# Altium schematic sheet ESP32.SchDoc
size A; SheetNumber: 5; SheetTotal: 16
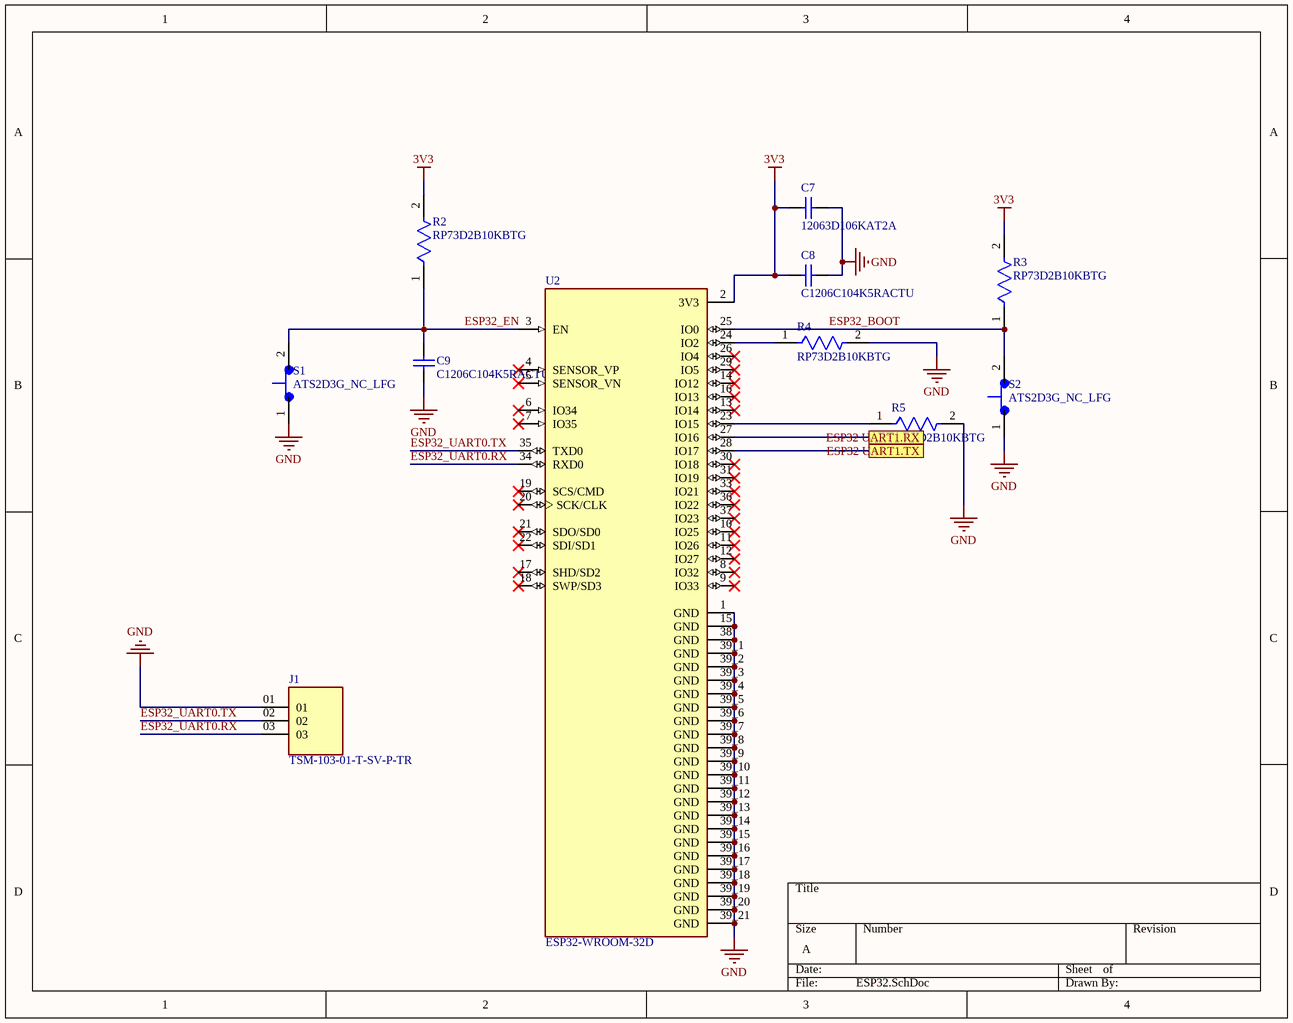
[diagram p0: ESP32.SchDoc]

## Parts
C7  12063D106KAT2A  [CAPC3216X229X50LL20T25]
C8  C1206C104K5RACTU  [KEMT-1206-2_M]
C9  C1206C104K5RACTU  [KEMT-1206-2_M]
J1  TSM-103-01-T-SV-P-TR  [SAMTEC_TSM-103-01-T-SV-P-TR]
R2  RP73D2B10KBTG  [FP-RP732B-MFG]
R3  RP73D2B10KBTG  [FP-RP732B-MFG]
R4  RP73D2B10KBTG  [FP-RP732B-MFG]
R5  RP73D2B10KBTG  [FP-RP732B-MFG]
S1  ATS2D3G_NC_LFG  [SW_ATS2D3G_NC_LFG]
S2  ATS2D3G_NC_LFG  [SW_ATS2D3G_NC_LFG]
U2  ESP32-WROOM-32D  [MODULE_ESP32-WROOM-32D]

## Ports
ESP32 UART1.RX, ESP32 UART1.TX

## Nets
3V3: C7.1 C8.1 R2.2 R3.2 U2.2(3V3)
GND: C7.2 C8.2 C9.1 J1.01 R4.2 R5.2 S1.1 S2.1 U2.1(GND) U2.15(GND) U2.38(GND) U2.39_1(GND) U2.39_2(GND) U2.39_3(GND) U2.39_4(GND) U2.39_5(GND) U2.39_6(GND) U2.39_7(GND) U2.39_8(GND) U2.39_9(GND) U2.39_10(GND) U2.39_11(GND) U2.39_12(GND) U2.39_13(GND) U2.39_14(GND) U2.39_15(GND) U2.39_16(GND) U2.39_17(GND) U2.39_18(GND) U2.39_19(GND) U2.39_20(GND) U2.39_21(GND)
ESP32 UART1.RX: U2.27(IO16) ; port ESP32 UART1.RX
ESP32 UART1.TX: U2.28(IO17) ; port ESP32 UART1.TX
ESP32_BOOT: R3.1 S2.2 U2.25(IO0)
ESP32_EN: C9.2 R2.1 S1.2 U2.3(EN)
ESP32_UART0.RX: J1.03 U2.34(RXD0)
ESP32_UART0.TX: J1.02 U2.35(TXD0)
NetR4_1: R4.1 U2.24(IO2)
NetR5_1: R5.1 U2.23(IO15)

Not connected (* = marked no-connect by the designer): U2 4(SENSOR_VP)* 5(SENSOR_VN)* 6(IO34)* 7(IO35)* 8(IO32)* 9(IO33)* 10(IO25)* 11(IO26)* 12(IO27)* 13(IO14)* 14(IO12)* 16(IO13)* 17(SHD/SD2)* 18(SWP/SD3)* 19(SCS/CMD)* 20(SCK/CLK)* 21(SDO/SD0)* 22(SDI/SD1)* 26(IO4)* 29(IO5)* 30(IO18)* 31(IO19)* 33(IO21)* 36(IO22)* 37(IO23)*

## Library data of the parts
C7 = CMP-2000-05863-1: Chip Capacitor, 10 uF, +/- 10%, 25 V, -55 to 85 degC, 1206 (3216 Metric), RoHS, Tape and Reel; Manufacturer: AVX; Rated Voltage: 25V; Dielectric: X5R; Capacitance: 10µF; Mounting Technology: SurfaceMount; Package Reference: 1206; Tolerance (%): ±10%; Manufacturer URL: http://www.avx.com/; Datasheet URL: http://datasheets.avx.com/cx5r.pdf; Package Description: 2-Pin Surface Mount Device, Body 3.2 x 1.6 mm; Datasheet Version: 05/2016; Case Size/Dimension: 1206
C8 C9 = CMP-1037-04202-2: CAP, Ceramic, 0.1 uF, +/- 10%, 50 V, -55 to 125 degC, 1206 (3216 Metric), RoHS, Tape and Reel; Manufacturer: Kemet; Voltage Rating: 50V; Capacitance: 0.1µF; Product Range: KEMET-CSeries; SVHC: ToBeAdvised; Dielectric Characteristic: X7R; Capacitor Case Style: 1206[3216Metric]; Package Reference: 1206-2; Package Description: 2-Leads SMD, Body 3.2 x 1.6 mm; Packaging: Tape&Reel; Operating Temperature Max: 125degC; Capacitance Tolerance: ±10%; Datasheet URL: https://datasheet.ciiva.com/6125/1725438-6125494.pdf; Manufacturer URL: http://www.kemet.com/; Operating Temperature Min: -55degC; Datasheet Version: Jul-13
J1 = TSM-103-01-T-SV-P-TR: MF: Samtec; Package: None; Availability: Unavailable; Value: *; MP: TSM-103-01-T-SV-P-TR; Price: None
R2-R5 = CMP-03211-008372-1: Res Thin Film 1206 10KΩ 0.1% 0.25W 15ppm/°C Molded SMD; Manufacturer: TE Connectivity; Voltage Rating: 200V; Temperature Range High: 155°C; packaging: 250 cut tape length; Composition: Thin Film; Category: Res; octopart_url: https://octopart.com/rp73d2b10kbtg-te+connectivity-42012630; ComponentLink2Description: Datasheet; Lead Free: Yes; Resistance: 10KΩ; Octopart: https://octopart.com/rp73d2b10kbtg-te+connectivity-42012630; Manufacturer Part Number: RP73D2B10KBTG; Temperature Coefficient: 15ppm/°C; Device Class L2: Resistors; Automotive: No; Ipc Land Pattern Name: RESC305155X55; Temperature: -55°C to 155°C; Device Class L1: Passive Components; Device Class L3: Chip SMD Resistors; Value: 10KΩ; Height: 0.65mm; Power Rating: 0.25W; Package: RP732B; Tolerance: 0.1%; Series: RP73; ComponentLink2URL: https://www.te.com/commerce/DocumentDelivery/DDEController?Action=showdoc&DocId=Data+Sheet%7F1773272%7FL%7Fpdf%7FEnglish%7FENG_DS_1773272_L.pdf%7F8-1879255-6; RoHS: TRUE; Temperature Range Low: -55°C
S1 S2 = ATS2D3G_NC_LFG: Tactile Switch SPST-NC Top Actuated Surface Mount; Package: None; Price: None; Value: *; MP: ATS2D3G_NC_LFG; Availability: Unavailable
U2 = ESP32-WROOM-32D: Bluetooth, WiFi 802.11b/g/n, Bluetooth v4.2 + EDR, Class 1, 2 and 3 Transceiver Module 2.4GHz ~ 2.5GHz Integrated, Trace Surface Mount; MF: Espressif Systems; Price: None; Package: Module Espressif Systems; Availability: Unavailable; SnapEDA_Link: https://www.snapeda.com/parts/ESP32-WROOM-32D/Espressif%20Systems/view-part/2768115/?ref=snap; Value: *; MP: ESP32-WROOM-32D